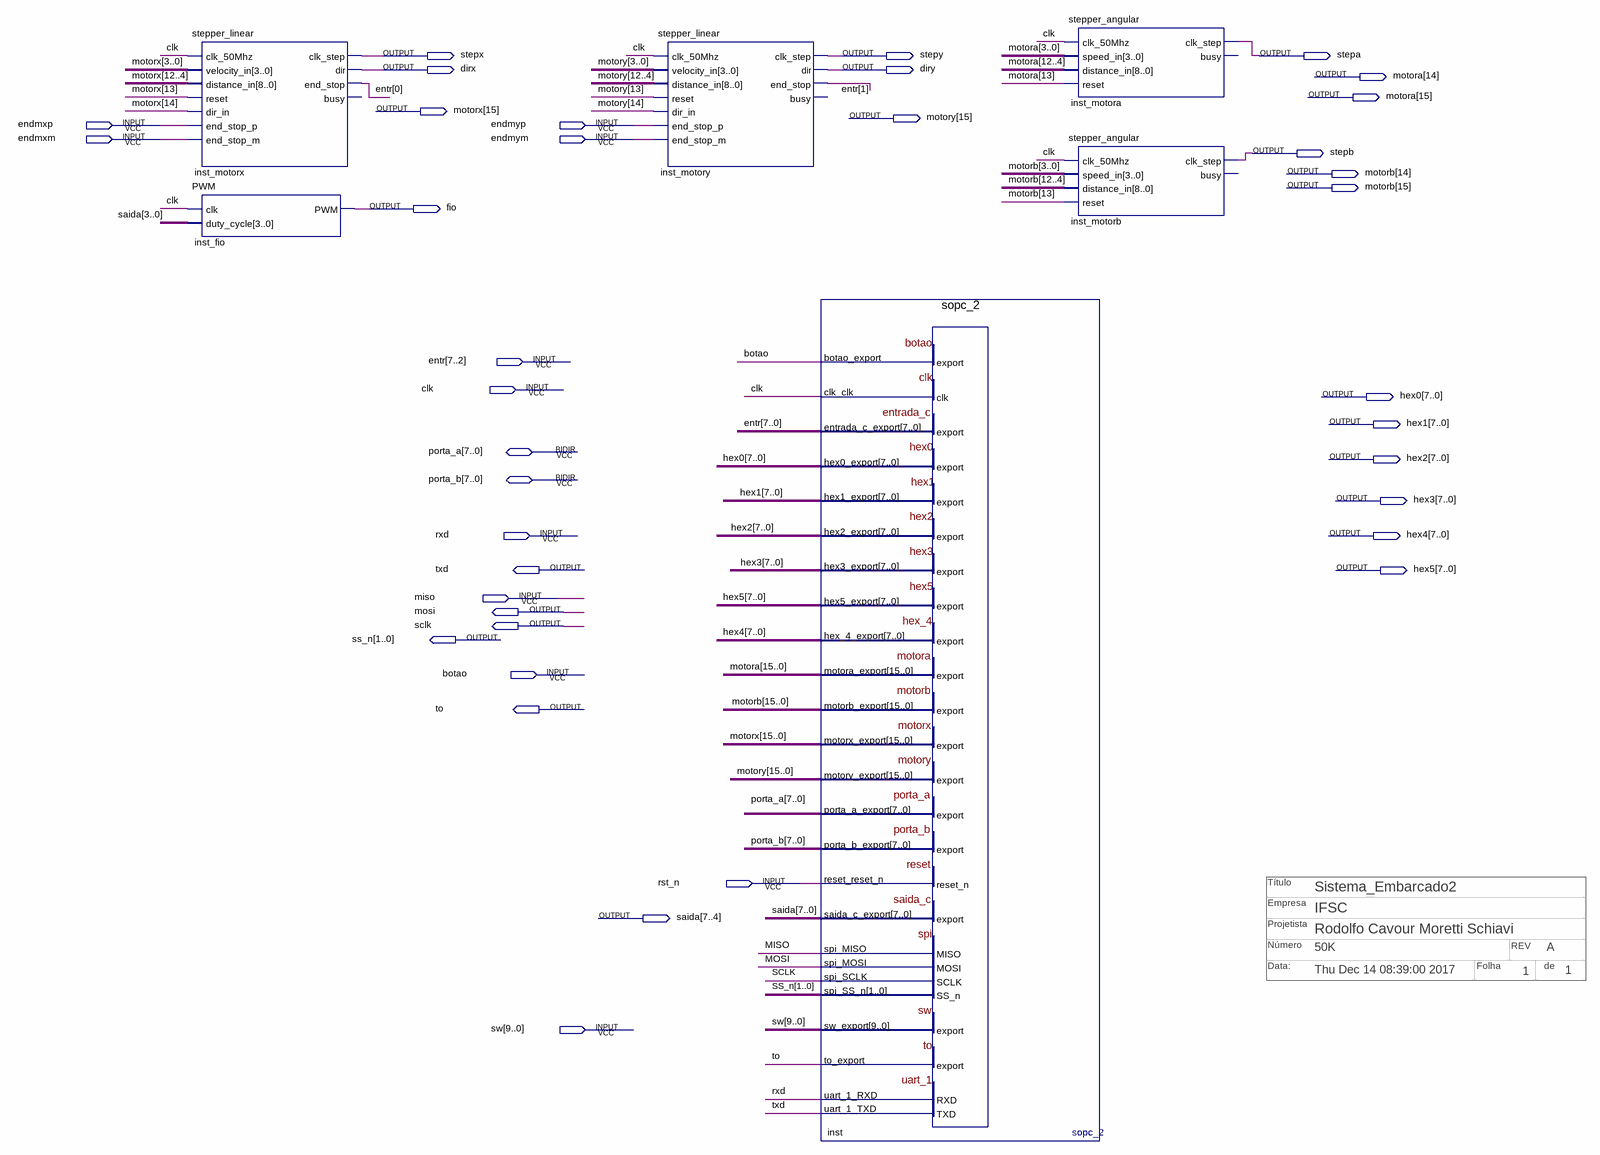
[diagram p0: schematic sheet]
// Quartus schematic sistema_basico2.bdf as structural Verilog: 6 symbols, 38 pins
// Title block: Data:: Thu Dec 14 08:39:00 2017; Empresa: IFSC; Folha: 1; Número: 50K; Projetista: Rodolfo Cavour Moretti Schiavi; REV: A; Título: Sistema_Embarcado2; de: 1
module sistema_basico2 (
  input  endmxp,
  input  endmyp,
  input  endmxm,
  input  endmym,
  input  [7:0] entr,
  input  clk,
  input  rxd,
  input  miso,
  input  botao,
  input  rst_n,
  input  [9:0] sw,
  inout  [7:0] porta_a,
  inout  [7:0] porta_b,
  output stepx,
  output stepy,
  output stepa,
  output dirx,
  output diry,
  output [15:0] motora,
  output [15:0] motorx,
  output [15:0] motory,
  output stepb,
  output [15:0] motorb,
  output fio,
  output [7:0] hex0,
  output [7:0] hex1,
  output [7:0] hex2,
  output [7:0] hex3,
  output [7:0] hex4,
  output txd,
  output [7:0] hex5,
  output mosi,
  output sclk,
  output [1:0] ss_n,
  output to,
  output [7:0] saida
);

  stepper_linear inst_motorx (
    .clk_50Mhz(clk), .velocity_in(motorx[3:0]), .distance_in(motorx[12:4]), .reset(motorx[13]),
    .dir_in(motorx[14]), .end_stop_p(endmxp), .end_stop_m(endmxm), .clk_step(stepx), .dir(dirx),
    .end_stop(entr[0]));  // open: busy
  PWM inst_fio (.clk(clk), .duty_cycle(saida[3:0]), .PWM(fio));
  stepper_linear inst_motory (
    .clk_50Mhz(clk), .velocity_in(motory[3:0]), .distance_in(motory[12:4]), .reset(motory[13]),
    .dir_in(motory[14]), .end_stop_p(endmyp), .end_stop_m(endmym), .clk_step(stepy), .dir(diry),
    .end_stop(entr[1]));  // open: busy
  sopc_2 inst (
    .botao_export(botao), .clk_clk(clk), .entrada_c_export(entr), .reset_reset_n(rst_n), .spi_MISO(miso),
    .sw_export(sw), .uart_1_RXD(rxd), .hex0_export(hex0), .hex1_export(hex1), .hex2_export(hex2),
    .hex3_export(hex3), .hex5_export(hex5), .hex_4_export(hex4), .motora_export(motora),
    .motorb_export(motorb), .motorx_export(motorx), .motory_export(motory), .saida_c_export(saida),
    .spi_MOSI(mosi), .spi_SCLK(sclk), .spi_SS_n(ss_n), .to_export(to), .uart_1_TXD(txd),
    .porta_a_export(porta_a), .porta_b_export(porta_b));
  stepper_angular inst_motora (
    .clk_50Mhz(clk), .speed_in(motora[3:0]), .distance_in(motora[12:4]), .reset(motora[13]), .clk_step(stepa));  // open: busy
  stepper_angular inst_motorb (
    .clk_50Mhz(clk), .speed_in(motorb[3:0]), .distance_in(motorb[12:4]), .reset(motorb[13]), .clk_step(stepb));  // open: busy
endmodule
